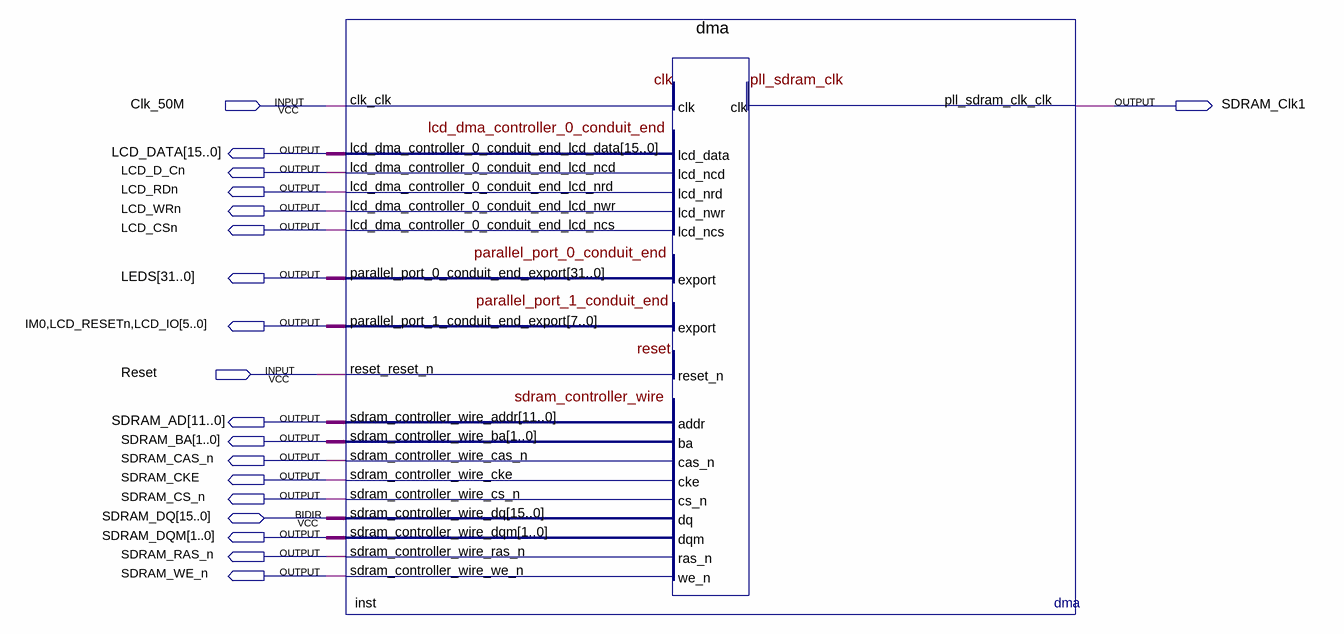
[diagram p0: schematic sheet]
// Quartus schematic top.bdf as structural Verilog: 1 symbols, 19 pins
module top (
  input  Clk_50M,
  input  Reset,
  inout  [15:0] SDRAM_DQ,
  output SDRAM_Clk1,
  output [15:0] LCD_DATA,
  output LCD_D_Cn,
  output LCD_RDn,
  output LCD_WRn,
  output LCD_CSn,
  output [31:0] LEDS,
  output IM0,
  output LCD_RESETn,
  output [5:0] LCD_IO,
  output [11:0] SDRAM_AD,
  output [1:0] SDRAM_BA,
  output SDRAM_CAS_n,
  output SDRAM_CKE,
  output SDRAM_CS_n,
  output [1:0] SDRAM_DQM,
  output SDRAM_RAS_n,
  output SDRAM_WE_n
);

  dma inst (
    .clk_clk(Clk_50M), .reset_reset_n(Reset), .lcd_dma_controller_0_conduit_end_lcd_ncd(LCD_D_Cn),
    .lcd_dma_controller_0_conduit_end_lcd_nrd(LCD_RDn), .lcd_dma_controller_0_conduit_end_lcd_nwr(LCD_WRn),
    .lcd_dma_controller_0_conduit_end_lcd_ncs(LCD_CSn), .pll_sdram_clk_clk(SDRAM_Clk1),
    .sdram_controller_wire_addr(SDRAM_AD), .sdram_controller_wire_ba(SDRAM_BA),
    .sdram_controller_wire_cas_n(SDRAM_CAS_n), .sdram_controller_wire_cke(SDRAM_CKE),
    .sdram_controller_wire_cs_n(SDRAM_CS_n), .sdram_controller_wire_dqm(SDRAM_DQM),
    .sdram_controller_wire_ras_n(SDRAM_RAS_n), .sdram_controller_wire_we_n(SDRAM_WE_n),
    .lcd_dma_controller_0_conduit_end_lcd_data(LCD_DATA), .parallel_port_0_conduit_end_export(LEDS),
    .parallel_port_1_conduit_end_export({IM0, LCD_RESETn, LCD_IO}), .sdram_controller_wire_dq(SDRAM_DQ));
endmodule
